# EAGLE design rs232 transcriver (EAGLE 5.08)
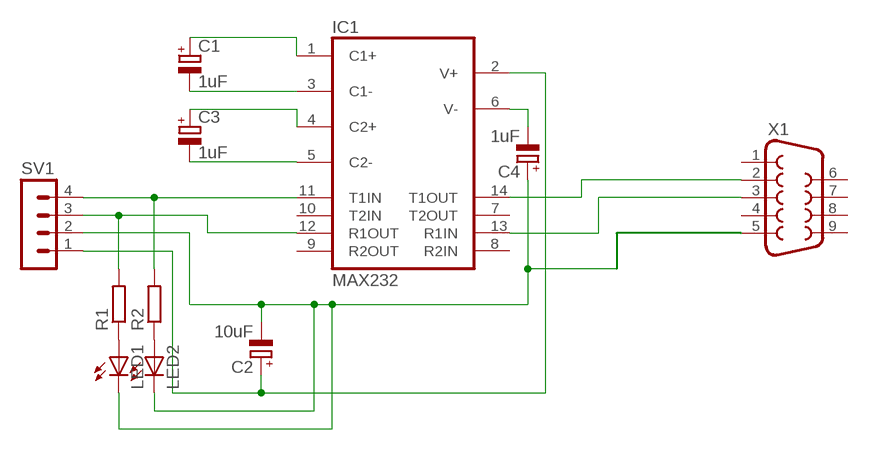
[diagram p0: schematic, sheet 1]

## Parts
C1  1uF  CPOL-EUE1.8-4  [E1,8-4]
C2  10uF  CPOL-EUE1.8-4  [E1,8-4]
C3  1uF  CPOL-EUE1.8-4  [E1,8-4]
C4  1uF  CPOL-EUE1.8-4  [E1,8-4]
IC1  MAX232  [DIL16]
LED1  LED3MM  [LED3MM]
LED2  LED3MM  [LED3MM]
R1  R-EU_0204/7  [0204/7]
R2  R-EU_0204/7  [0204/7]
SV1  MA04-1  [MA04-1]
X1  F09HP  [F09HP]

## Nets
N$1: IC1.14(T1OUT) X1.2
N$2: IC1.13(R1IN) X1.3
N$3: LED1.A R1.1
N$4: C1.+ IC1.1(C1+)
N$5: C1.- IC1.3(C1-)
N$6: IC1.11(T1IN) R2.2 SV1.4
N$7: LED2.A R2.1
N$8: C3.+ IC1.4(C2+)
N$9: IC1.12(R1OUT) R1.2 SV1.3
N$10: C3.- IC1.5(C2-)
N$11: C4.- IC1.6(V-)
N$12: C2.- C4.+ LED1.K(C) LED2.K(C) SV1.2 X1.5
N$13: C2.+ IC1.2(V+) SV1.1
Unconnected: IC1.7(T2OUT) IC1.8(R2IN) IC1.9(R2OUT) IC1.10(T2IN) X1.1 X1.4 X1.6 X1.7 X1.8 X1.9

## Power pins joined to a net without a drawn wire
GND: IC1.15(GND)
VCC: IC1.16(VCC)

## Library data of the parts
C1-C4 = rcl:CPOL-EU: POLARIZED CAPACITOR, European symbol
IC1 = maxim:MAX232: RS232 TRANSEIVER
LED1 LED2 = led:LED: LED OSRAM: - CHIPLED LG R971, LG N971, LY N971, LG Q971, LY Q971, LO R971, LY R971 LH N974, LH R974 LS Q976, LO Q976, LY Q976 LO Q996 - Hyper CHIPLED LW Q18S LB Q993, LB Q99A, LB R99A - SideLED LS A670, LO A670, LY A670, LG A670, LP A670 LB A673, LV A673, LT A673, LW A673 LH A674 LY A675 LS A676, LA A676, LO A676, LY A676, LW A676 LS A679, LY A679, LG A679 - Hyper Micro SIDELED® LS Y876, LA Y876, LO Y876, LY Y876 LT Y87S - SmartLED LW L88C, LW L88S LB L89C, LB L89S, LG L890 LS L89K, LO L89K, LY L89K LS L896, LA L896, LO L896, LY L896 - TOPLED LS T670, LO T670, LY T670, LG T670, LP T670 LSG T670, LSP T670, LSY T670, LOP T670, LYG T670 LG T671, LOG T671, LSG T671 LB T673, LV T673, LT T673, LW T673 LH T674 LS T676, LA T676, LO T676, LY T676, LB T676, LH T676, LSB T676, LW T676 LB T67C, LV T67C, LT T67C, LS T67K, LO T67K, LY T67K, LW E67C LS E67B, LA E67B, LO E67B, LY E67B, LB E67C, LV E67C, LT E67C LW T67C LS T679, LY T679, LG T679 LS T770, LO T770, LY T770, LG T770, LP T770 LB T773, LV T773, LT T773, LW T773 LH T774 LS E675, LA E675, LY E675, LS T675 LS T776, LA T776, LO T776, LY T776, LB T776 LHGB T686 LT T68C, LB T68C - Hyper Mini TOPLED® LB M676 - Mini TOPLED Santana® LG M470 LS M47K, LO M47K, LY M47K Source: http://www.osram.convergy.de LUXEON: - LUMILED® LXK2-PW12-R00, LXK2-PW12-S00, LXK2-PW14-U00, LXK2-PW14-V00 LXK2-PM12-R00, LXK2-PM12-S00, LXK2-PM14-U00 LXK2-PE12-Q00, LXK2-PE12-R00, LXK2-PE12-S00, LXK2-PE14-T00, LXK2-PE14-U00 LXK2-PB12-K00, LXK2-PB12-L00, LXK2-PB12-M00, LXK2-PB14-N00, LXK2-PB14-P00, LXK2-PB14-Q00 LXK2-PR12-L00, LXK2-PR12-M00, LXK2-PR14-Q00, LXK2-PR14-R00 LXK2-PD12-Q00, LXK2-PD12-R00, LXK2-PD12-S00 LXK2-PH12-R00, LXK2-PH12-S00 LXK2-PL12-P00, LXK2-PL12-Q00, LXK2-PL12-R00 Source: www.luxeon.com KINGBRIGHT: KA-3528ASYC Source: www.kingbright.com
R1 R2 = rcl:R-EU_: RESISTOR, European symbol
SV1 = con-lstb:MA04-1: PIN HEADER
X1 = con-subd:F09: SUB-D

## Net classes
0 default: width 0.381 mm, drill 0.762 mm, clearance 0.254 mm

## Board
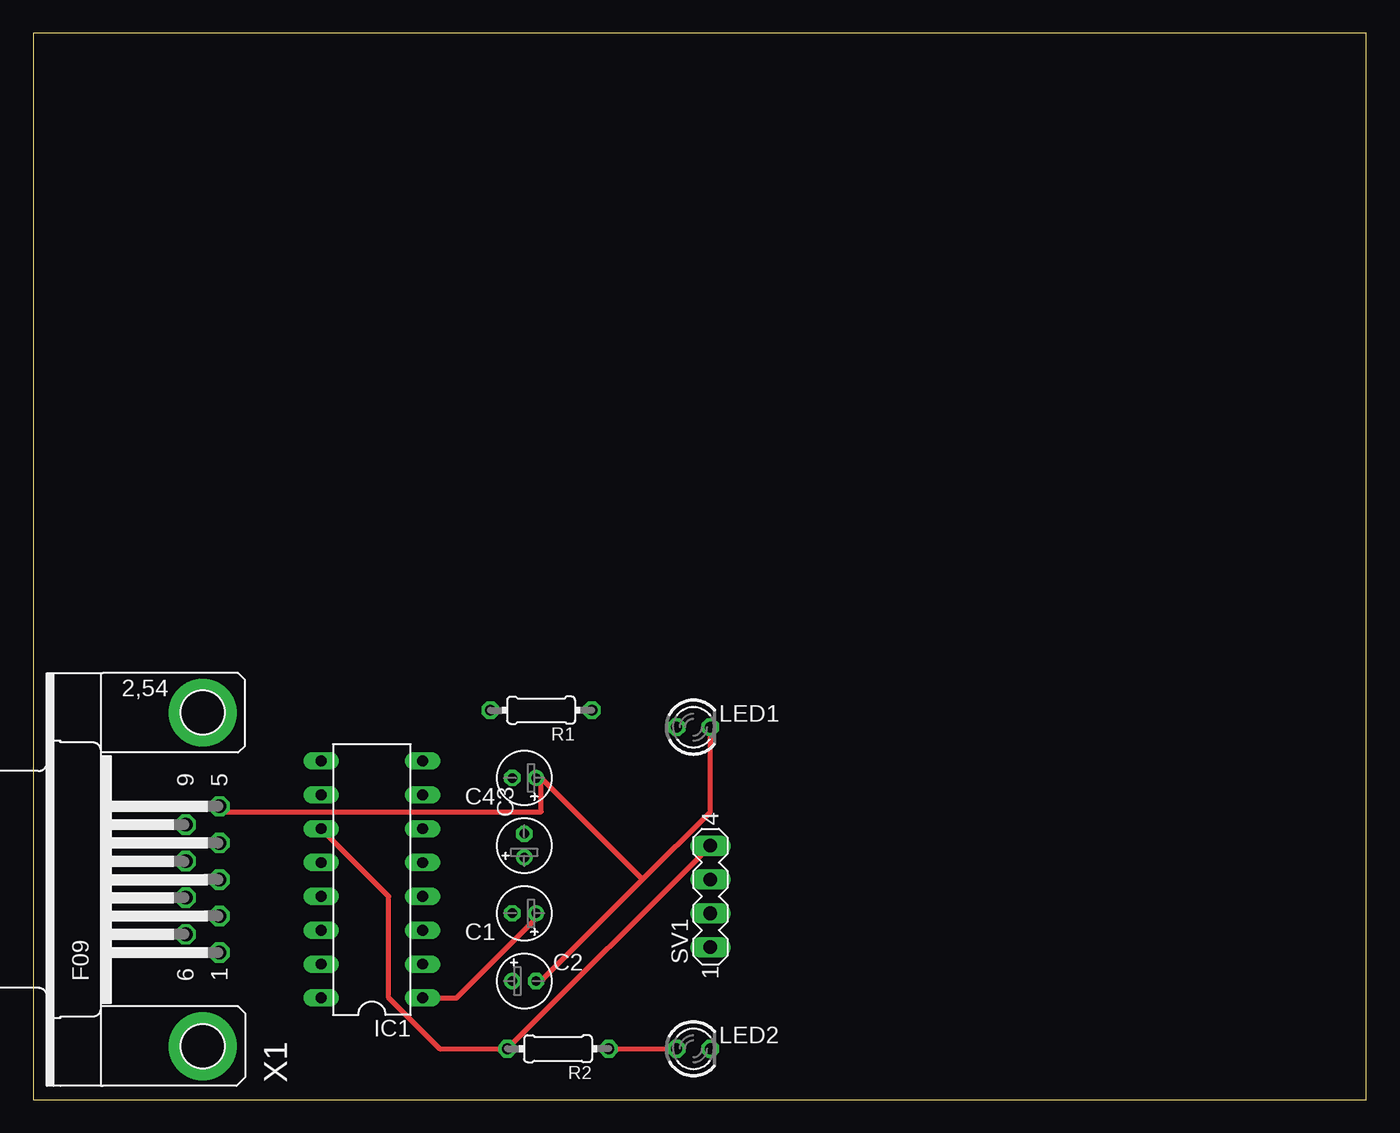
[diagram p1: board, top side]
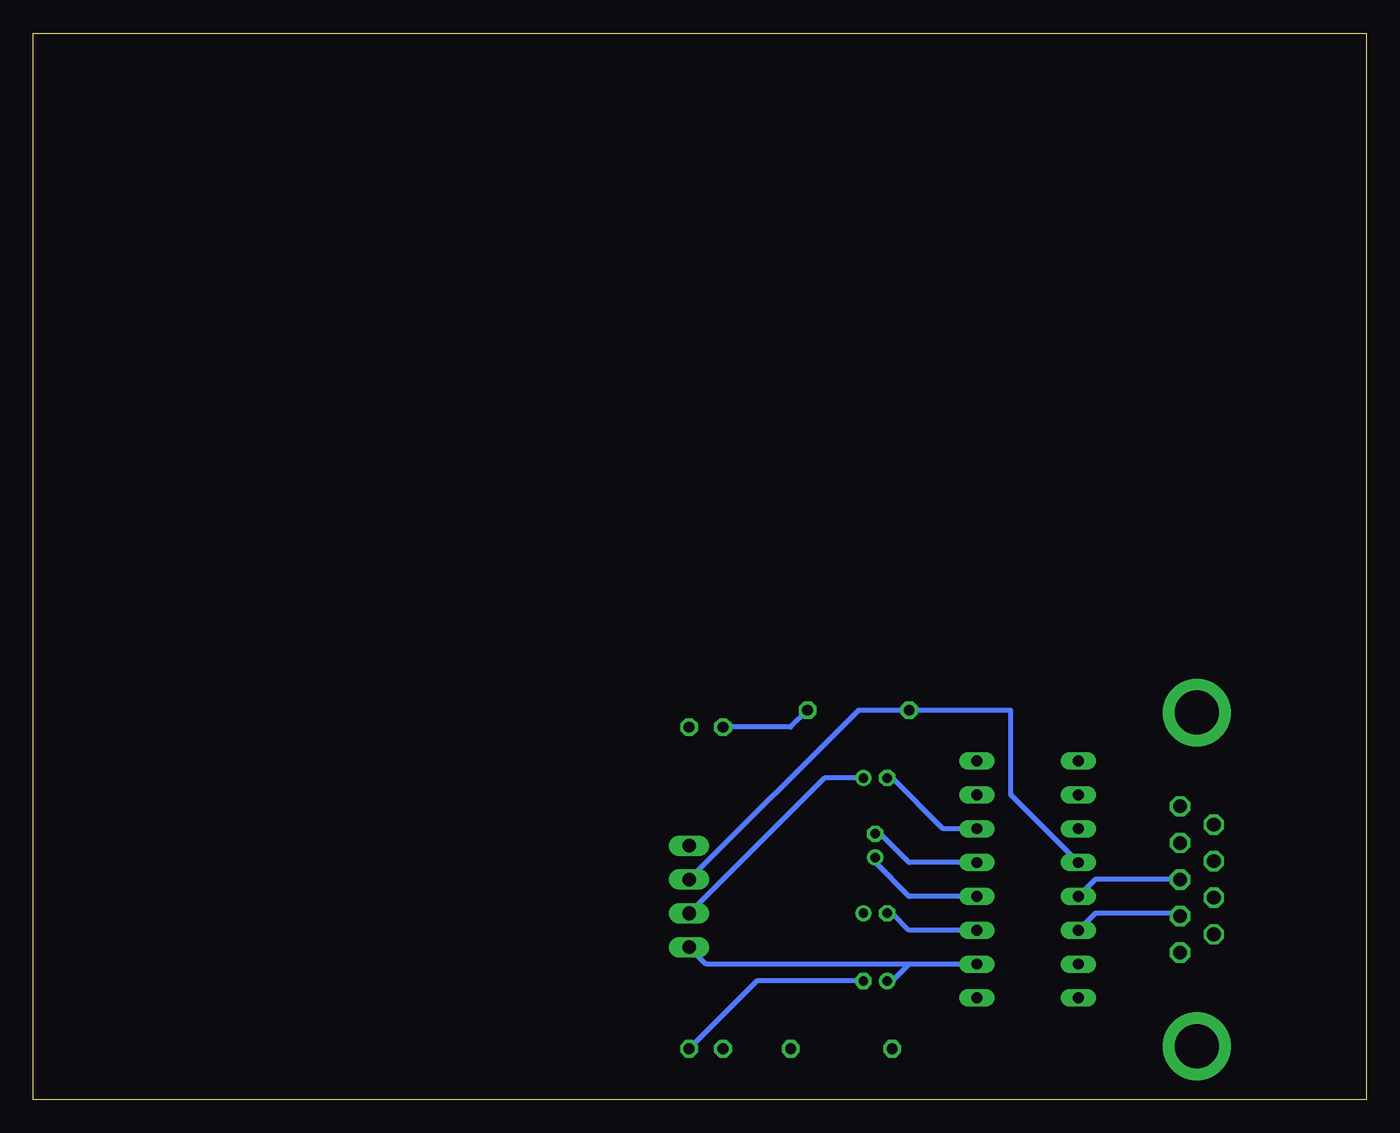
[diagram p2: board, bottom side, seen from below]

Size 100 x 80 mm. Coordinates in mm from the lower left corner, seen from the top.
Outline: 0,0 100,0 100,80 0,80 0,0
Copper layers (1*16): Top 0.035mm / dielectric 1.5mm / Bottom 0.035mm
Design rules "default": minimum track width 10mil, minimum drill 24mil, track to track 8mil, track to pad 8mil, pad to pad 8mil, via to via 8mil, smd to smd 8mil, copper to edge 40mil, drill to drill 8mil, minimum pad ring 10mil, minimum via ring 8mil, stop-mask expansion 4mil, vias tented up to drill 0mil, thermal gap 10mil

### Footprints (pad centres in the part's own frame; a part is rotated, then mirrored left to right if it is on the bottom)
E1,8-4 = drill 0.711 pad 1.168 round: + -0.889,0 | drill 0.711 pad 1.168 octagon: - 0.889,0
DIL16 = drill 0.813 long: 1 -8.89,-3.81; 2 -6.35,-3.81; 3 -3.81,-3.81; 4 -1.27,-3.81; 5 1.27,-3.81; 6 3.81,-3.81; 7 6.35,-3.81; 8 8.89,-3.81; 9 8.89,3.81; 10 6.35,3.81; 11 3.81,3.81; 12 1.27,3.81; 13 -1.27,3.81; 14 -3.81,3.81; 15 -6.35,3.81; 16 -8.89,3.81
LED3MM = drill 0.813 octagon: A -1.27,0; K 1.27,0
0204/7 = drill 0.813 octagon: 1 -3.81,0; 2 3.81,0
MA04-1 = drill 1.016 long: 1 -3.81,0; 2 -1.27,0; 3 1.27,0; 4 3.81,0
F09HP = drill 1.016 octagon: 1 -5.486,-1.27; 2 -2.743,-1.27; 3 0,-1.27; 4 2.743,-1.27; 5 5.486,-1.27; 6 -4.115,1.27; 7 -1.372,1.27; 8 1.372,1.27; 9 4.115,1.27 | drill 3.302 pad 5.08 round: G1 -12.522,0; G2 12.522,0

### Placement (x,y rotation side)
C1  36.83,13.97 180 top
C2  36.83,8.89 0 top
C3  36.83,19.05 90 top
C4  36.83,24.13 180 top
IC1  25.4,16.51 90 top
LED1  49.53,27.94 0 top
LED2  49.53,3.81 0 top
R1  38.1,29.21 180 top
R2  39.37,3.81 180 top
SV1  50.8,15.24 90 top
X1  12.7,16.51 90 top

### Tracks (layer width: path | path; a pad name or v marks a point on that pad's centre or on a via)
N$1
  Bottom 0.381: IC1.14 20.32,13.97 13.97,13.97 X1.2
N$2
  Bottom 0.381: IC1.13 20.32,16.51 X1.3
N$3
  Bottom 0.381: R1.1 43.18,27.94 LED1.A
N$4
  Top 0.381: IC1.1 31.75,7.62 38.1,13.97 C1.+
N$5
  Bottom 0.381: IC1.3 34.29,12.7 35.56,13.97 C1.-
N$6
  Top 0.381: SV1.4 R2.2 30.48,3.81 26.67,7.62 26.67,15.24 IC1.11
N$7
  Top 0.381: R2.1 LED2.A
N$8
  Bottom 0.381: IC1.4 34.29,15.24 36.83,17.78 C3.+
N$9
  Bottom 0.381: IC1.12 26.67,22.86 26.67,29.21 R1.2 38.1,29.21 SV1.3
N$10
  Bottom 0.381: IC1.5 34.29,17.78 36.83,20.32 C3.-
N$11
  Bottom 0.381: IC1.6 31.75,20.32 35.56,24.13 C4.-
N$12
  Top 0.381: 45.72,16.51 50.8,21.59 LED1.K | 45.72,16.51 38.1,8.89 C2.- | 38.1,24.13 45.72,16.51 | 38.1,24.13 38.1,21.59 13.97,21.59 X1.5 | 38.1,24.13 C4.+
  Bottom 0.381: LED2.K 45.72,8.89 C2.- | SV1.2 40.64,24.13 C4.+
N$13
  Bottom 0.381: 34.29,10.16 35.56,8.89 C2.+ | IC1.2 34.29,10.16 | SV1.1 49.53,10.16 34.29,10.16